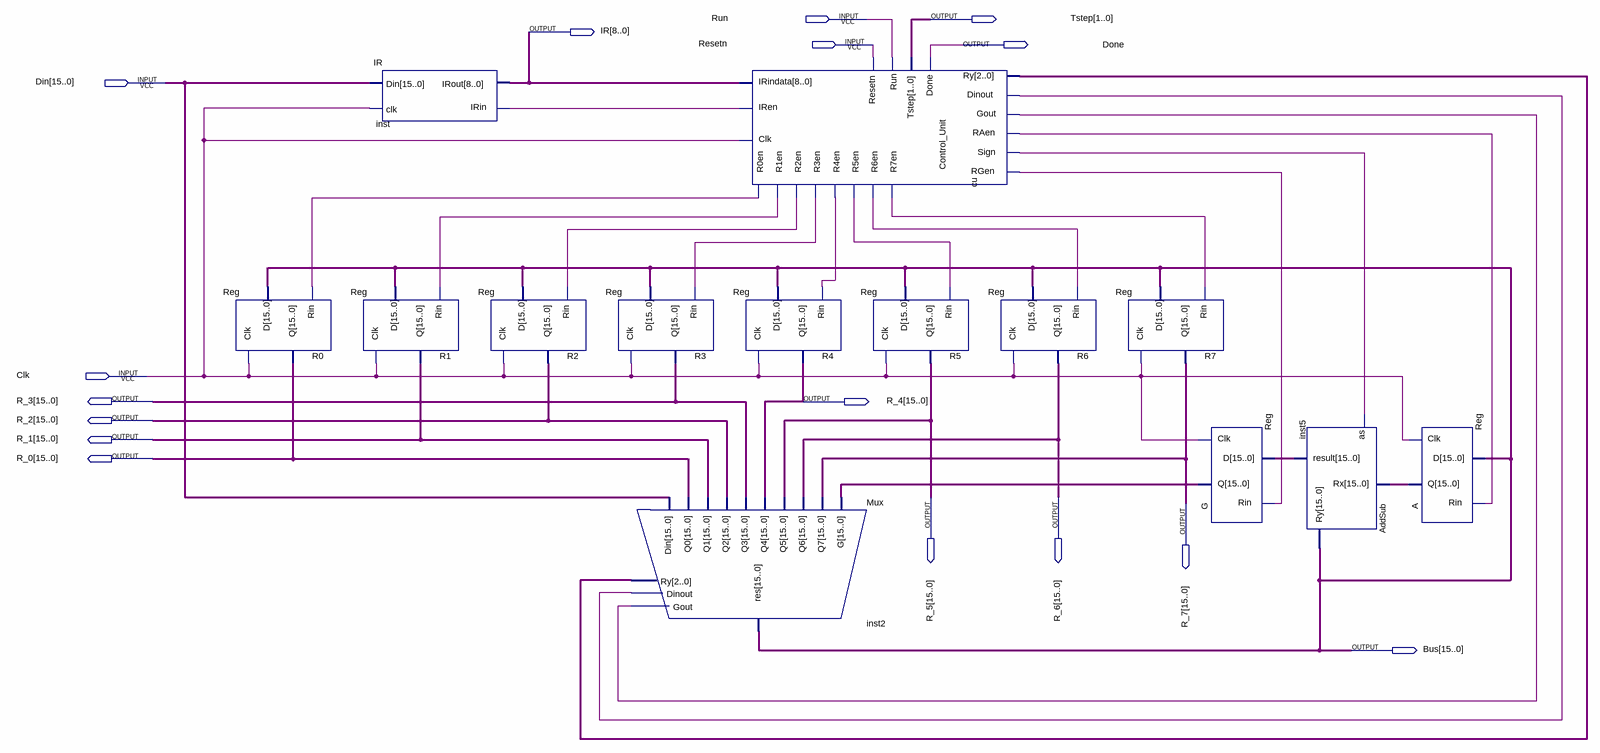
[diagram p0: schematic sheet]
// Quartus schematic cpu.bdf as structural Verilog: 14 symbols, 16 pins
module cpu (
  input  Run,
  input  Resetn,
  input  [15:0] Din,
  input  Clk,
  output [1:0] Tstep,
  output [8:0] IR,
  output Done,
  output [15:0] R_3,
  output [15:0] R_4,
  output [15:0] R_2,
  output [15:0] R_1,
  output [15:0] R_0,
  output [15:0] R_5,
  output [15:0] R_6,
  output [15:0] R_7,
  output [15:0] Bus
);

  wire cu_dinout, cu_gout, cu_iren, cu_r0en, cu_r1en, cu_r2en, cu_r3en, cu_r4en, cu_r5en, cu_r6en, cu_r7en,
       cu_raen, cu_rgen, cu_sign;
  wire [2:0] cu_ry;
  wire [15:0] A_q, G_q, inst5_result;

  Reg R0 (.D(Bus), .Clk(Clk), .Rin(cu_r0en), .Q(R_0));
  Reg R1 (.D(Bus), .Clk(Clk), .Rin(cu_r1en), .Q(R_1));
  IR inst (.Din(Din), .IRin(cu_iren), .clk(Clk), .IRout(IR));
  Reg R2 (.D(Bus), .Clk(Clk), .Rin(cu_r2en), .Q(R_2));
  Reg R3 (.D(Bus), .Clk(Clk), .Rin(cu_r3en), .Q(R_3));
  Mux inst2 (
    .Gout(cu_gout), .Dinout(cu_dinout), .Ry(cu_ry), .Din(Din), .Q0(R_0), .Q1(R_1), .Q2(R_2), .Q3(R_3),
    .Q4(R_4), .Q5(R_5), .Q6(R_6), .Q7(R_7), .G(G_q), .res(Bus));
  Control_Unit cu (
    .Run(Run), .Clk(Clk), .Resetn(Resetn), .IRindata(IR), .IRen(cu_iren), .R0en(cu_r0en), .R1en(cu_r1en),
    .R2en(cu_r2en), .R3en(cu_r3en), .R4en(cu_r4en), .R5en(cu_r5en), .R6en(cu_r6en), .R7en(cu_r7en),
    .RAen(cu_raen), .RGen(cu_rgen), .Sign(cu_sign), .Dinout(cu_dinout), .Gout(cu_gout), .Ry(cu_ry),
    .Done(Done), .Tstep(Tstep));
  Reg R4 (.D(Bus), .Clk(Clk), .Rin(cu_r4en), .Q(R_4));
  Reg R5 (.D(Bus), .Clk(Clk), .Rin(cu_r5en), .Q(R_5));
  Reg R6 (.D(Bus), .Clk(Clk), .Rin(cu_r6en), .Q(R_6));
  Reg R7 (.D(Bus), .Clk(Clk), .Rin(cu_r7en), .Q(R_7));
  Reg G (.D(inst5_result), .Clk(Clk), .Rin(cu_rgen), .Q(G_q));
  AddSub inst5 (.Rx(A_q), .Ry(Bus), .as(cu_sign), .result(inst5_result));
  Reg A (.D(Bus), .Clk(Clk), .Rin(cu_raen), .Q(A_q));
endmodule
